# Altium schematic sheet 5_CLOCK GENERATOR.SchDoc
size 419 x 296 mm; Author: Serbinov O.A.; CompanyName: ELSICOM; DrawnBy: Serbinov O.A.; Engineer: Serbinov O.A.; Organization: Elsicom; Address1: Kirova avenue, 58; Address2: Tomsk; Address3: Russia 634012; DocumentNumber: 6; SheetNumber: 6; SheetTotal: 44; ProjectName: 48_PORTS
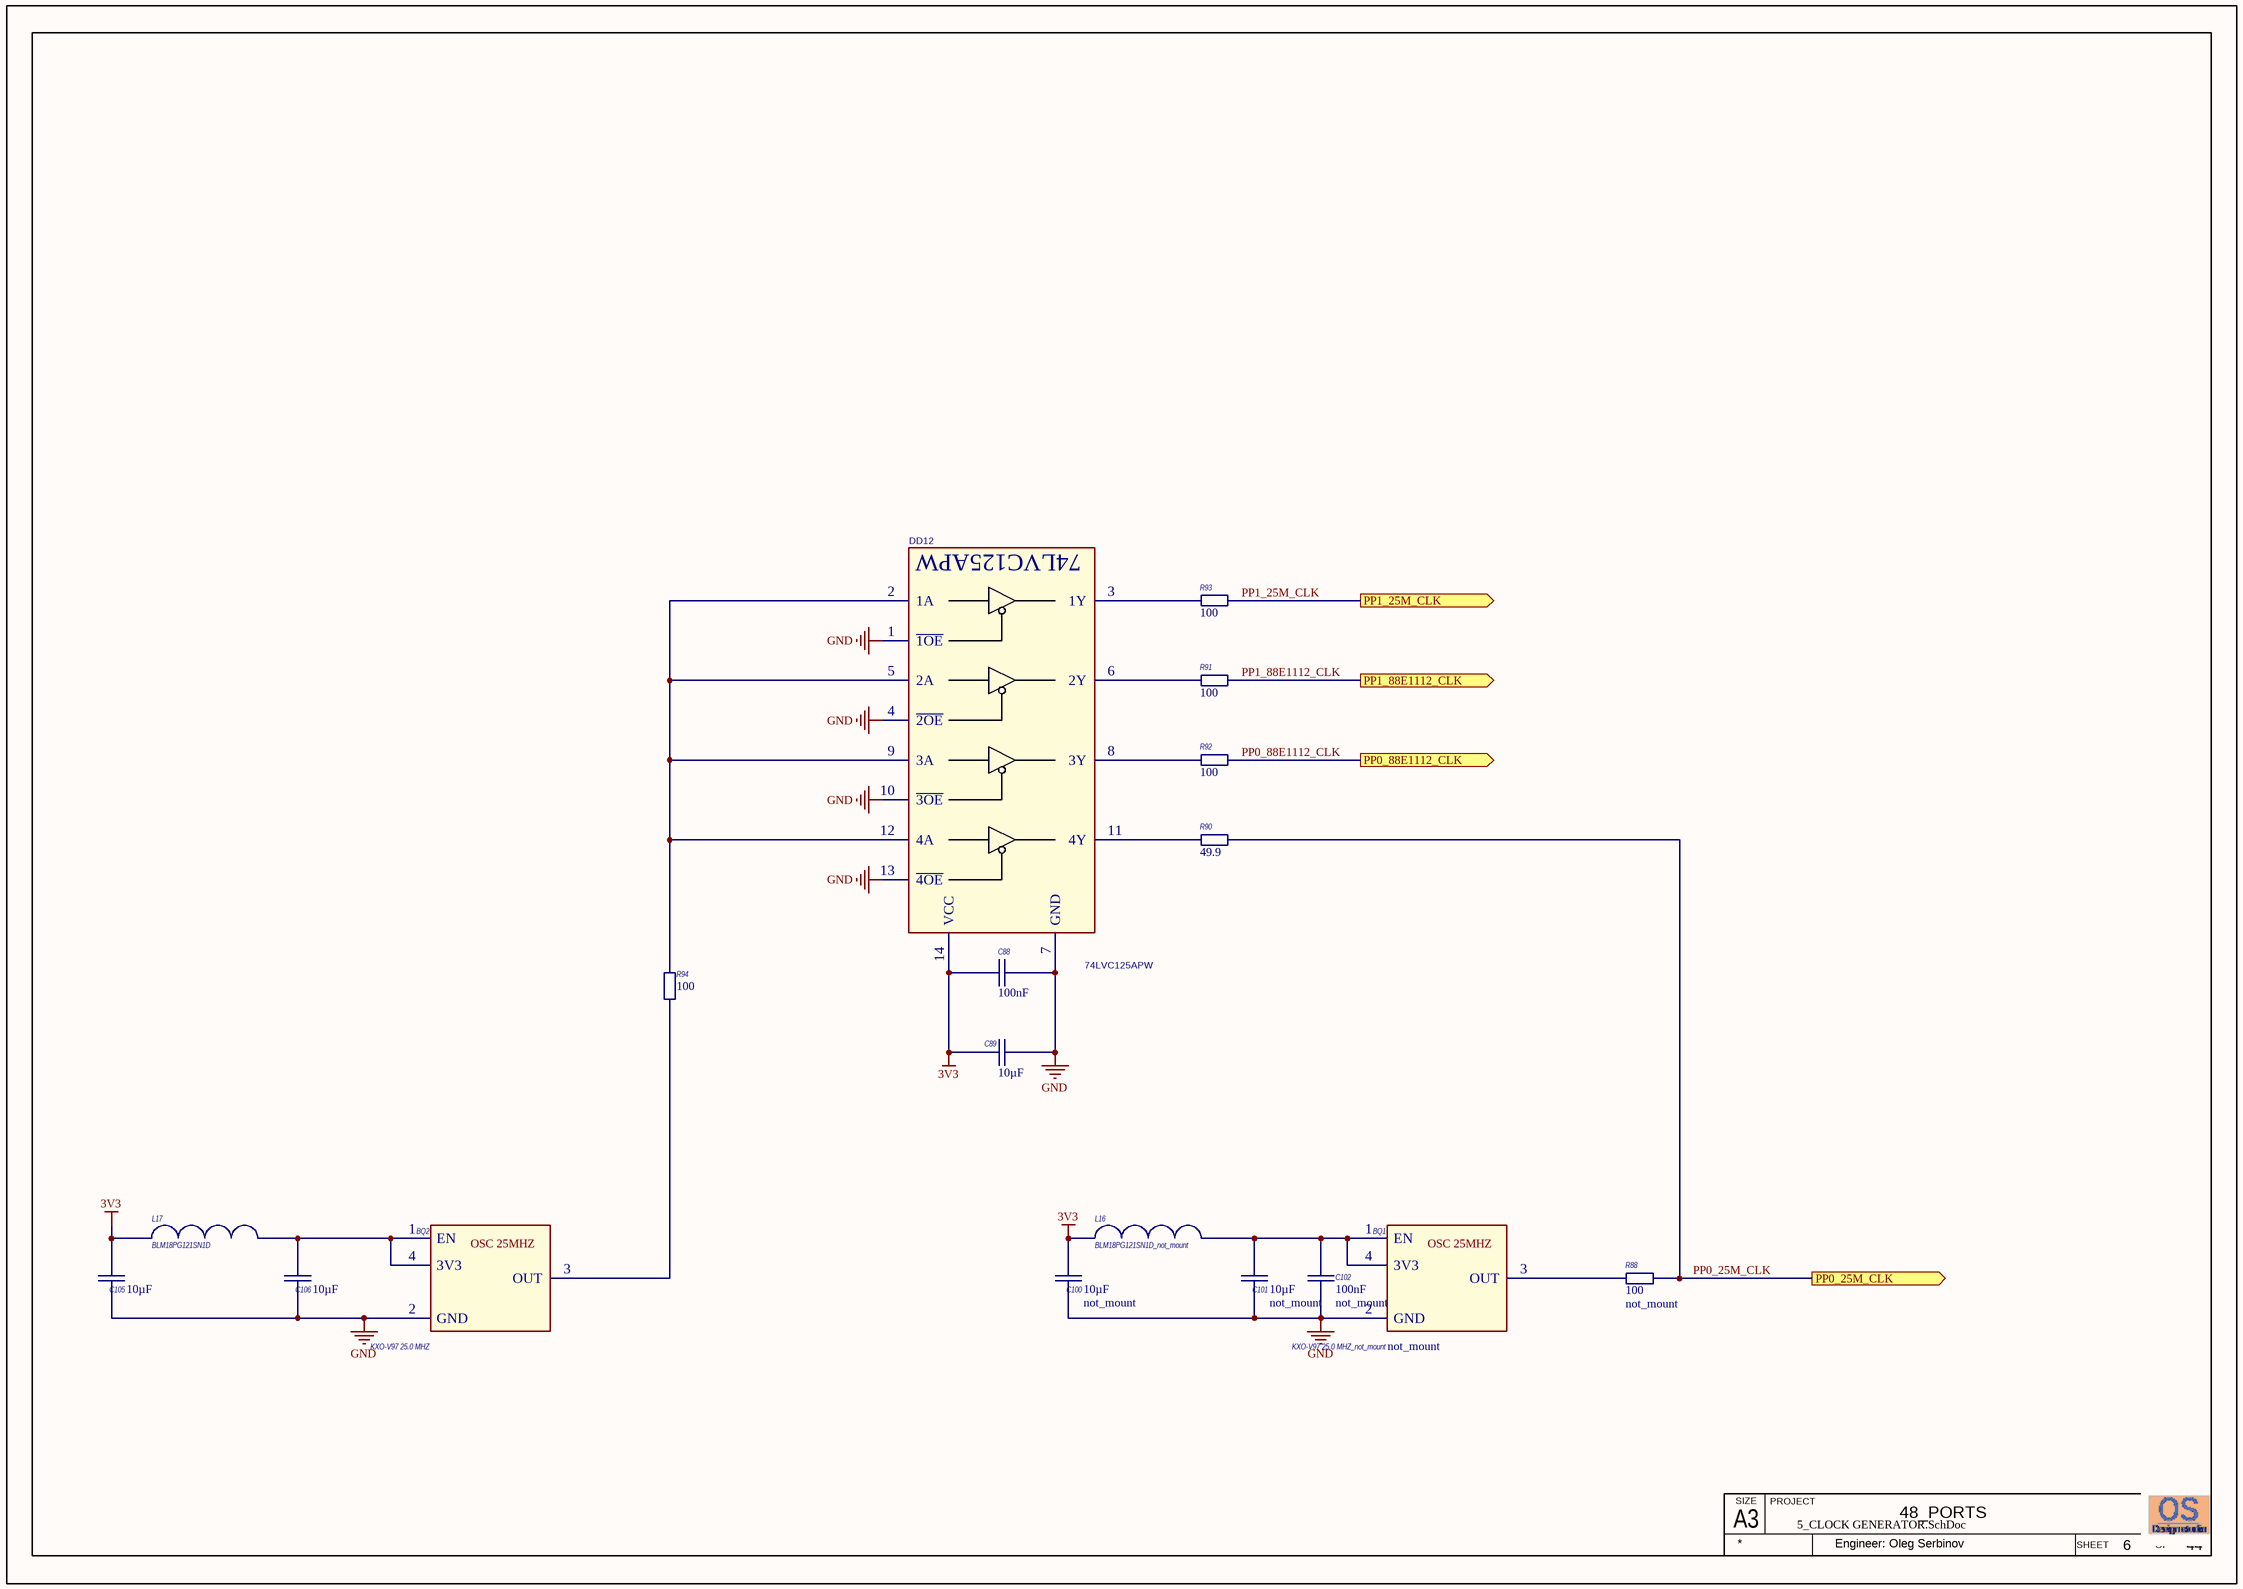
[diagram p0: 5_CLOCK GENERATOR.SchDoc]

## Parts
BQ1  KXO-V97 25.0 MHZ_not_mount  Notes: not_mount  [KXO-V97]
BQ2  KXO-V97 25.0 MHZ  [KXO-V97]
C88  Capacitance: 100nF  [C0402_IPC High Density]  (hidden comment: GRM155R71E104KE14D)
C89  Capacitance: 10µF  [CAPC2012[0805]]  (hidden comment: GRM21BR61C106KE15)
C100  Capacitance: 10µF  Notes: not_mount  [CAPC2012[0805]]  (hidden comment: GRM21BR61C106KE15_not_mount)
C101  Capacitance: 10µF  Notes: not_mount  [CAPC2012[0805]]  (hidden comment: GRM21BR61C106KE15_not_mount)
C102  Capacitance: 100nF  Notes: not_mount  [C0402_IPC High Density]  (hidden comment: GRM155R71C104KA88_not_mount)
C105  Capacitance: 10µF  [CAPC2012[0805]]  (hidden comment: GRM21BR61C106KE15)
C106  Capacitance: 10µF  [CAPC2012[0805]]  (hidden comment: GRM21BR61C106KE15)
DD12  74LVC125APW  [TSSOP-14]
L16  BLM18PG121SN1D_not_mount  [INDC1608X95N]
L17  BLM18PG121SN1D  [INDC1608X95N]
R88  Resistance: 100  Notes: not_mount  [R0402_IPC High Density]  (hidden comment: ERJ-2RKF1000X_not_mount)
R90  Resistance: 49.9  [R0402_IPC High Density]  (hidden comment: ERJ-2RKF49R9X)
R91  Resistance: 100  [R0402_IPC High Density]  (hidden comment: ERJ-2RKF1000X)
R92  Resistance: 100  [R0402_IPC High Density]  (hidden comment: ERJ-2RKF1000X)
R93  Resistance: 100  [R0402_IPC High Density]  (hidden comment: ERJ-2RKF1000X)
R94  Resistance: 100  [R0402_IPC High Density]  (hidden comment: ERJ-2RKF1000X)

## Ports
PP0_25M_CLK (out), PP0_88E1112_CLK (out), PP1_25M_CLK (out), PP1_88E1112_CLK (out)

## Nets
3V3: C88.1 C89.1 C100.1 C105.1 DD12.14(VCC) L16.1 L17.1
GND: BQ1.2(GND) BQ2.2(GND) C88.2 C89.2 C100.2 C101.2 C102.1 C105.2 C106.2 DD12.1(~{1OE}) DD12.4(~{2OE}) DD12.7(GND) DD12.10(~{3OE}) DD12.13(~{4OE})
PP0_25M_CLK: R88.1 R90.1 ; port PP0_25M_CLK
PP0_88E1112_CLK: R92.1 ; port PP0_88E1112_CLK
PP1_25M_CLK: R93.1 ; port PP1_25M_CLK
PP1_88E1112_CLK: R91.1 ; port PP1_88E1112_CLK
NetBQ1_1: BQ1.1(EN) BQ1.4(3V3) C101.1 C102.2 L16.2
NetBQ1_3: BQ1.3(OUT) R88.2
NetBQ2_1: BQ2.1(EN) BQ2.4(3V3) C106.1 L17.2
NetBQ2_3: BQ2.3(OUT) R94.2
NetDD12_2: DD12.2(1A) DD12.5(2A) DD12.9(3A) DD12.12(4A) R94.1
NetDD12_3: DD12.3(1Y) R93.2
NetDD12_6: DD12.6(2Y) R91.2
NetDD12_8: DD12.8(3Y) R92.2
NetDD12_11: DD12.11(4Y) R90.2

## Notes on the sheet
- A3
- SIZE
- PROJECT
- SHEET
- OF
- Engineer: Oleg Serbinov
- (in symbol Oscillator 25MHZ 3.3V) OSC 25MHZ
- (in symbol Oscillator 25MHZ 3.3V_not_mount) OSC 25MHZ

## Library data of the parts
BQ1 = Oscillator 25MHZ 3.3V_not_mount: Oscillator 25MHZ 3.3V HCMOS SMT_not_mount; Manufacturer: EYER ELECTRONIC; Customer Part Number: Генератор, Oscillator 25MHZ 3.3V HCMOS, 7050; Frequency: 25; No. of Pins: 4; SVHC: No SVHC (19-Dec-2012); Analogs: CB3LV-3I-25M0000, ASV-25.000MHZ-C-T, AGXO-25.000M-3.3V-S7050-CS-C-O, CB3LV3I25M000; Supplier Part Number 1: 23M6598; Manufacturer Part Number: KXO-V97 25.0 MHZ; RoHS: YES; Stock: 66; Pricing: 1=5.46, 50=4.94, 100=4.54, 250=4.19, 500=3.91 (USD); Operating Temperature Min: -40; Operating Temperature Max: 85
BQ2 = Oscillator 25MHZ 3.3V: Oscillator 25MHZ 3.3V HCMOS SMT; Manufacturer: EYER ELECTRONIC; Customer Part Number: Генератор, Oscillator 25MHZ 3.3V HCMOS, 7050; Frequency: 25; No. of Pins: 4; SVHC: No SVHC (19-Dec-2012); Analogs: CB3LV-3I-25M0000, ASV-25.000MHZ-C-T, AGXO-25.000M-3.3V-S7050-CS-C-O, CB3LV3I25M000; Supplier Part Number 1: 23M6598; Manufacturer Part Number: KXO-V97 25.0 MHZ; RoHS: YES; Stock: 66; Pricing: 1=5.46, 50=4.94, 100=4.54, 250=4.19, 500=3.91 (USD); Operating Temperature Min: -40; Operating Temperature Max: 85
C88 = GRM155R71E104KE14D: C0402, 100nF, 25V, X7R; Manufacturer: Murata; Rmanufacturer: Yageo  Samsung  TDK  Taiyo Yuden  Kemet; Customer Part Number: Конденсатор, 100n, 0402, 25V, X7R, 10%; Capacitance Tolerance: ± 10%; Voltage Rating: 16; Capacitor Case Style: 0402 [1005 Metric]; Capacitor Terminals: SMD; SVHC: No SVHC (19-Dec-2012); No. of Pins: 2; Reel Quantity: 10000; Tolerance +: 10%; Analogs: any suitable; Manufacturer Part Number: GRM155R71E104KE14D; RoHS: YES; Packaging: Reel; Package / Case: 0402; ComponentLink1URL: http://www.farnell.com/datasheets/4360.pdf; ComponentLink1Description: http://www.farnell.com/datasheets/4360.pdf; Pricing: 10000=0.008593, 30000=0.007991 (GBP); Supplier 1: Farnell; Supplier Part Number 1: 1118151; Stock: 3; Dielectric Characteristic: X7R; Operating Temperature Min: -55; Operating Temperature Max: 125; Operating Temperature Range: -55°C to +125; Series: GRM Hi-Cap; Terminal Type: Surface Mount (SMD, SMT); Tolerance -: 10%; Voltage Rating V DC: 16
C89 C105 C106 = GRM21BR61C106KE15: C0805, 10uF 10%, 16V, X5R; Manufacturer: Murata; Customer Part Number: Конденсатор, 10u, 0805, 16V, X5R, 10%; Analogs: any suitable; Applications: General Purpose; Category: Capacitors; Operating Temperature: -55°C ~ 85°C; Package / Case: 0805 (2012 Metric); Size / Dimension: 0.079" L x 0.049" W (2.00mm x 1.25mm); Temperature Coefficient: X5R; Tolerance: ±10%; ComponentLink1URL: http://search.murata.co.jp/Ceramy/image/img/PDF/ENG/GRM21BR61C106KE15.pdf; ComponentLink1Description: http://search.murata.co.jp/Ceramy/image/img/PDF/ENG/GRM21BR61C106KE15.pdf; Pricing: 1=0.3, 10=0.25, 50=0.1408, 100=0.1252, 250=0.09392, 500=0.08294, 1000=0.07356 (USD); Voltage - Rated: 16V; Manufacturer Part Number: GRM21BR61C106KE15
C100 C101 = GRM21BR61C106KE15_not_mount: C0805, 10uF 10%, 16V, X5R; Manufacturer: Murata; Customer Part Number: Конденсатор, 10u, 0805, 16V, X5R, 10%; Analogs: any suitable; Applications: General Purpose; Category: Capacitors; Operating Temperature: -55°C ~ 85°C; Package / Case: 0805 (2012 Metric); Size / Dimension: 0.079" L x 0.049" W (2.00mm x 1.25mm); Temperature Coefficient: X5R; Tolerance: ±10%; ComponentLink1URL: http://search.murata.co.jp/Ceramy/image/img/PDF/ENG/GRM21BR61C106KE15.pdf; ComponentLink1Description: http://search.murata.co.jp/Ceramy/image/img/PDF/ENG/GRM21BR61C106KE15.pdf; Pricing: 1=0.3, 10=0.25, 50=0.1408, 100=0.1252, 250=0.09392, 500=0.08294, 1000=0.07356 (USD); Voltage - Rated: 16V; Manufacturer Part Number: GRM21BR61C106KE15
C102 = GRM155R71C104KA88_not_mount: C0402, 100nF, 16V, X7R; Manufacturer: Murata; Rpart number: CC0402KRX7R7BB104 ; CL05B104KO5NNNC ; C1005X7R1C104K050BC ; EMK105B7104KV-F ; C0402C104K4RAC7411; Rmanufacturer: Yageo  Samsung  TDK  Taiyo Yuden  Kemet; Customer Part Number: Конденсатор, 100n, 0402, 16V, X7R, 10%; Capacitance Tolerance: ± 10%; Dielectric Characteristic: X7; Voltage Rating: 16; Capacitor Case Style: 0402 [1005 Metric]; Capacitor Terminals: SMD; SVHC: No SVHC (19-Dec-2012); No. of Pins: 2; Reel Quantity: 10000; Tolerance +: 10%; Analogs: any suitable; RoHS: YES; Packaging: Reel; Package / Case: 0402; ComponentLink1URL: http://www.farnell.com/datasheets/4360.pdf; ComponentLink1Description: http://www.farnell.com/datasheets/4360.pdf; Pricing: 10000=0.008593, 30000=0.007991 (GBP); Supplier 1: Farnell; Supplier Part Number 1: 1118151; Stock: 3; Operating Temperature Min: -55; Operating Temperature Max: 125; Operating Temperature Range: -55°C to +125; Series: GRM Hi-Cap; Terminal Type: Surface Mount (SMD, SMT); Tolerance -: 10%; Voltage Rating V DC: 16; Manufacturer Part Number: GRM155R71C104KA88
DD12 = 74LVC125APW: IC BUFFERS 4 bit, 4 nS  TSSOP14; Manufacturer: Texas Instruments; Manufacturer Part Number: SN74LVC125APWR; Rpart number: SN74LVC125APWR ; 74LVC125APW; Customer Part Number: Микросхема, 74LVC125APW, IC BUFF DVR TRI-ST QD, 14-TSSOP; Current - Output High, Low: 24mA, 24mA; Voltage - Supply: 1.65 V ~ 3.6 V; Logic Type: Buffer/Line Driver, Non-Inverting; Number of Bits per Element: 1; Number of Elements: 4; Category: Integrated Circuits (ICs); Supplier: Digi-Key; Operating Temperature: -40°C ~ 125°C; Mounting Type: Surface Mount; RoHS: RoHS Compliant; Packaging: Digi-Reel®; Package / Case: 14-TSSOP (0.173", 4.40mm Width); Supplier Device Package: 14-TSSOP; ComponentLink1URL: http://www.ti.com/lit/ds/symlink/sn74lvc125a.pdf; ComponentLink1Description: http://www.ti.com/lit/ds/symlink/sn74lvc125a.pdf; Pricing: 1=0.47, 10=0.368, 25=0.31, 100=0.2527, 250=0.20932, 500=0.1729, 1000=0.1295 (USD); Supplier 1: Digi-Key; Supplier Part Number: 296-1222-6-ND; Supplier Part Number 1: 296-1222-6-ND; Rmanufacturer: Texas Instruments; Analogs: SN74LVC125APWR ; 74LVC125APW
L16 = BLM18PG121SN1D_not_mount: FILTER BLM18 (0603, 2A)_not_mount; Manufacturer: MURATA; Manufacturer Part Number: BLM18PG471SN1D; Customer Part Number: Дроссель, BLM18PG121SN1D, FERRITE BEAD 120 OHM 1LN, 0603; DC Resistance Max: 0.05; Impedance: 120; Ferrite Mounting: SMD; Inductor Type: Ferrite Bead; SVHC: No SVHC (19-Dec-2011); Ferrite Case Style: 0603 / 1608; Core Material: Ferrite; DC Current Max: 2000; Inductor Case Style: 0603; Inductance Tolerance: ± 25%; No. of Pins: 2; Analogs: MH1608-601Y ; MI0603J601R-10 ; BLM18PG471SH1D ; 742792651 ; 742792645; RoHS: YES; Operating Temperature Min: -55; Mounting Type: SMD; Operating Temperature Max: +125; Package / Case: 0603; Impedance @ 100MHz Typ: 120; Resistance: 0.05; Supplier Part Number: 1515738; Supplier: Farnell; ComponentLink1URL: http://www.farnell.com/datasheets/5148.pdf; ComponentLink1Description: http://www.farnell.com/datasheets/5148.pdf; Pricing: 5=0.056, 50=0.041, 100=0.034, 250=0.028, 500=0.027 (GBP); DC Current Rating: 2A; Notes: not_mount
L17 = BLM18PG121SN1D: FILTER BLM18 (0603, 2A); Manufacturer: Murata; Rpart number: MPZ1608S121ATAH0 ; CIC10P121NC ; MPZ1608S121ATDH5 ; BLM18PG121SH1D ; 742792625; Rmanufacturer: Boruns  Samsung  TDK  Murata  Wurth Electronics; Customer Part Number: Дроссель, BLM18PG121SN1D, FERRITE BEAD 120 OHM 1LN, 0603; DC Resistance Max: 0.05; Impedance: 120; Ferrite Mounting: SMD; Inductor Type: Ferrite Bead; SVHC: No SVHC (19-Dec-2011); Ferrite Case Style: 0603 / 1608; Core Material: Ferrite; DC Current Max: 2000; Inductor Case Style: 0603; Inductance Tolerance: ± 25%; No. of Pins: 2; RoHS: YES; Operating Temperature Min: -55; Mounting Type: SMD; Operating Temperature Max: +125; Package / Case: 0603; Impedance @ 100MHz Typ: 120; Resistance: 0.05; Supplier Part Number: 1515738; Supplier: Farnell; ComponentLink1URL: http://www.farnell.com/datasheets/5148.pdf; ComponentLink1Description: http://www.farnell.com/datasheets/5148.pdf; Pricing: 5=0.056, 50=0.041, 100=0.034, 250=0.028, 500=0.027 (GBP); Manufacturer Part Number: BLM18PG121SN1D; DC Current Rating: 2A; Analogs: MPZ1608S121ATAH0 ; CIC10P121NC ; MPZ1608S121ATDH5 ; BLM18PG121SH1D ; 742792625
R88 = ERJ-2RKF1000X_not_mount: R0402, 100R 1%_not_mount; Manufacturer: Panasonic; Rpart number: RC0402FR-07100RL ; RC1005F101CS ; CRG0402F100R ; RMCF0402FT100R ; MCR01MZPF1000 ; MCR01MZPJ101; Rmanufacturer: Yageo  Samsung  Stackpole Electronics  Rohm Semiconductor  Vishay Dale; Customer Part Number: Резистор, 100R, 0402, 1%; Temperature Coefficient: 100 PPM / C; Tolerance: 1 %; Voltage Rating: 50 Volts; Power Rating: 100 mWatts; Analogs: any suitable; Supplier: Mouser; Category: Thick Film Resistors - SMD; Package / Case: 0402 (1005 metric); RoHS: RoHS Compliant By Exemption; Packaging: Reel; ComponentLink1URL: http://industrial.panasonic.com/www-data/pdf/AOA0000/AOA0000CE2.pdf; ComponentLink1Description: http://industrial.panasonic.com/www-data/pdf/AOA0000/AOA0000CE2.pdf; Minimum Order Quantity: 1; Series: ERJ; Product: Thick Film Resistors SMD; RoHS - Mouser: E; Reeling: True; Termination Style: SMD/SMT; Standard Pack Qty: 10000; Operating Temperature Range: - 55 C to + 155 C; Dimensions: 0.5 mm W x 1 mm L x 0.35 mm H; Manufacturer Part Number: ERJ-2RKF1000X
R90 = ERJ-2RKF49R9X: R0402, 49.9R 1%; Manufacturer: Panasonic; Rpart number: RC0402FR-0749R9L ; RC1005F49R9CS ; MCR01MRTF49R9 ; CRCW040249R9FKED ; CR0402-FX-49R9GLF; Rmanufacturer: Yageo  Samsung  Stackpole Electronics  Rohm Semiconductor  Vishay Dale; Customer Part Number: Резистор, 49R9, 0402, 1%; Temperature Coefficient: 100 PPM / C; Voltage Rating: 50 Volts; Power Rating: 100 mWatts; Analogs: any suitable; Supplier: Mouser; Category: Thick Film Resistors - SMD; Package / Case: 0402 (1005 metric); Tolerance: 1 %; RoHS: RoHS Compliant By Exemption; Packaging: Reel; ComponentLink1URL: http://industrial.panasonic.com/www-data/pdf/AOA0000/AOA0000CE2.pdf; ComponentLink1Description: http://industrial.panasonic.com/www-data/pdf/AOA0000/AOA0000CE2.pdf; Minimum Order Quantity: 1; Series: ERJ; Product: Thick Film Resistors SMD; RoHS - Mouser: E; Reeling: True; Termination Style: SMD/SMT; Standard Pack Qty: 10000; Operating Temperature Range: - 55 C to + 155 C; Dimensions: 0.5 mm W x 1 mm L x 0.35 mm H; Supplier Part Number: 667-ERJ-2RKF49R9X; Manufacturer Part Number: ERJ-2RKF49R9X; Product Category: .; Pricing: 1=0.135, 25=0.032, 100=0.024, 250=0.018, 500=0.014, 1000=0.008, 2000=0.007, 5000=0.004 (AUD)
R91-R94 = ERJ-2RKF1000X: R0402, 100R 1%; Manufacturer: Panasonic; Rpart number: RC0402FR-07100RL ; RC1005F101CS ; CRG0402F100R ; RMCF0402FT100R ; MCR01MZPF1000 ; MCR01MZPJ101; Rmanufacturer: Yageo  Samsung  Stackpole Electronics  Rohm Semiconductor  Vishay Dale; Customer Part Number: Резистор, 100R, 0402, 1%; Temperature Coefficient: 100 PPM / C; Voltage Rating: 50 Volts; Power Rating: 100 mWatts; Analogs: any suitable; Supplier: Mouser; Category: Thick Film Resistors - SMD; Package / Case: 0402 (1005 metric); Tolerance: 1 %; RoHS: RoHS Compliant By Exemption; Packaging: Reel; ComponentLink1URL: http://industrial.panasonic.com/www-data/pdf/AOA0000/AOA0000CE2.pdf; ComponentLink1Description: http://industrial.panasonic.com/www-data/pdf/AOA0000/AOA0000CE2.pdf; Minimum Order Quantity: 1; Series: ERJ; Product: Thick Film Resistors SMD; RoHS - Mouser: E; Reeling: True; Termination Style: SMD/SMT; Standard Pack Qty: 10000; Operating Temperature Range: - 55 C to + 155 C; Dimensions: 0.5 mm W x 1 mm L x 0.35 mm H; Manufacturer Part Number: ERJ-2RKF1000X